# Altium schematic sheet In_Out.SchDoc
size A3
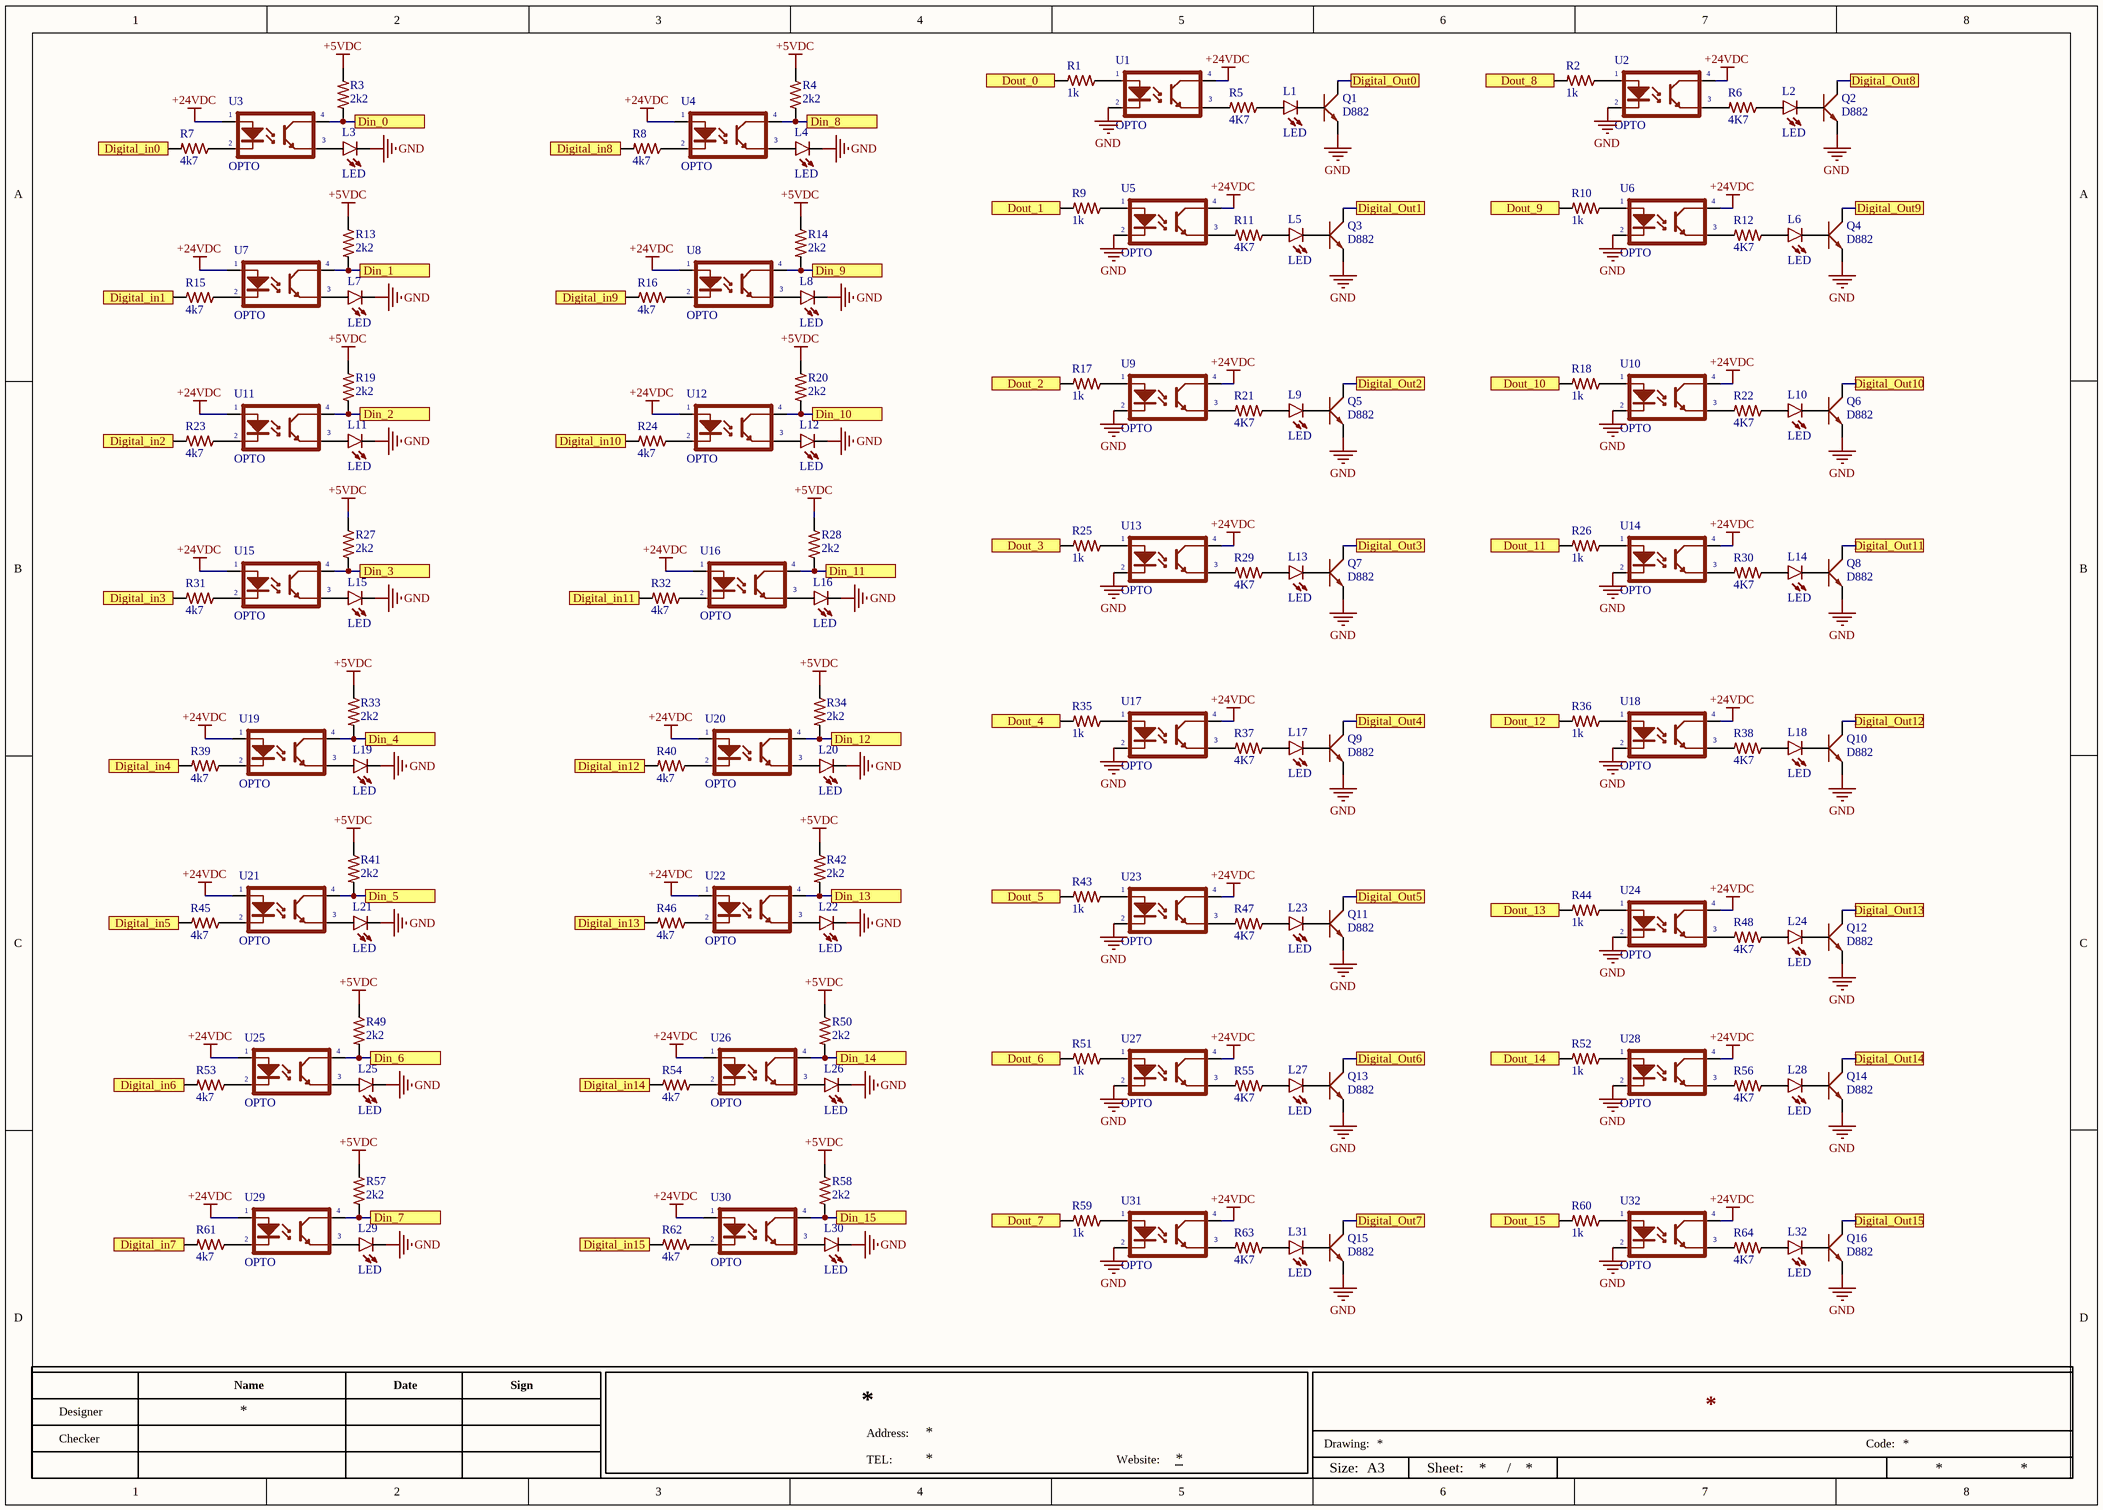
[diagram p0: In_Out.SchDoc]

## Parts
L1  LED  [LED_GREEN_SMD_0603]
L2  LED  [LED_GREEN_SMD_0603]
L3  LED  [LED_RED_SMD_0603]
L4  LED  [LED_RED_SMD_0603]
L5  LED  [LED_GREEN_SMD_0603]
L6  LED  [LED_GREEN_SMD_0603]
L7  LED  [LED_RED_SMD_0603]
L8  LED  [LED_RED_SMD_0603]
L9  LED  [LED_GREEN_SMD_0603]
L10  LED  [LED_GREEN_SMD_0603]
L11  LED  [LED_RED_SMD_0603]
L12  LED  [LED_RED_SMD_0603]
L13  LED  [LED_GREEN_SMD_0603]
L14  LED  [LED_GREEN_SMD_0603]
L15  LED  [LED_RED_SMD_0603]
L16  LED  [LED_RED_SMD_0603]
L17  LED  [LED_GREEN_SMD_0603]
L18  LED  [LED_GREEN_SMD_0603]
L19  LED  [LED_RED_SMD_0603]
L20  LED  [LED_RED_SMD_0603]
L21  LED  [LED_RED_SMD_0603]
L22  LED  [LED_RED_SMD_0603]
L23  LED  [LED_GREEN_SMD_0603]
L24  LED  [LED_GREEN_SMD_0603]
L25  LED  [LED_RED_SMD_0603]
L26  LED  [LED_RED_SMD_0603]
L27  LED  [LED_GREEN_SMD_0603]
L28  LED  [LED_GREEN_SMD_0603]
L29  LED  [LED_RED_SMD_0603]
L30  LED  [LED_RED_SMD_0603]
L31  LED  [LED_GREEN_SMD_0603]
L32  LED  [LED_GREEN_SMD_0603]
Q1  D882  [SOT89]
Q2  D882  [SOT89]
Q3  D882  [SOT89]
Q4  D882  [SOT89]
Q5  D882  [SOT89]
Q6  D882  [SOT89]
Q7  D882  [SOT89]
Q8  D882  [SOT89]
Q9  D882  [SOT89]
Q10  D882  [SOT89]
Q11  D882  [SOT89]
Q12  D882  [SOT89]
Q13  D882  [SOT89]
Q14  D882  [SOT89]
Q15  D882  [SOT89]
Q16  D882  [SOT89]
R1  1k  [RES_SMD0603]
R2  1k  [RES_SMD0603]
R3  2k2  [RES_SMD0603]
R4  2k2  [RES_SMD0603]
R5  4K7  [RES_SMD0603]
R6  4K7  [RES_SMD0603]
R7  4k7  [RES_SMD0603]
R8  4k7  [RES_SMD0603]
R9  1k  [RES_SMD0603]
R10  1k  [RES_SMD0603]
R11  4K7  [RES_SMD0603]
R12  4K7  [RES_SMD0603]
R13  2k2  [RES_SMD0603]
R14  2k2  [RES_SMD0603]
R15  4k7  [RES_SMD0603]
R16  4k7  [RES_SMD0603]
R17  1k  [RES_SMD0603]
R18  1k  [RES_SMD0603]
R19  2k2  [RES_SMD0603]
R20  2k2  [RES_SMD0603]
R21  4K7  [RES_SMD0603]
R22  4K7  [RES_SMD0603]
R23  4k7  [RES_SMD0603]
R24  4k7  [RES_SMD0603]
R25  1k  [RES_SMD0603]
R26  1k  [RES_SMD0603]
R27  2k2  [RES_SMD0603]
R28  2k2  [RES_SMD0603]
R29  4K7  [RES_SMD0603]
R30  4K7  [RES_SMD0603]
R31  4k7  [RES_SMD0603]
R32  4k7  [RES_SMD0603]
R33  2k2  [RES_SMD0603]
R34  2k2  [RES_SMD0603]
R35  1k  [RES_SMD0603]
R36  1k  [RES_SMD0603]
R37  4K7  [RES_SMD0603]
R38  4K7  [RES_SMD0603]
R39  4k7  [RES_SMD0603]
R40  4k7  [RES_SMD0603]
R41  2k2  [RES_SMD0603]
R42  2k2  [RES_SMD0603]
R43  1k  [RES_SMD0603]
R44  1k  [RES_SMD0603]
R45  4k7  [RES_SMD0603]
R46  4k7  [RES_SMD0603]
R47  4K7  [RES_SMD0603]
R48  4K7  [RES_SMD0603]
R49  2k2  [RES_SMD0603]
R50  2k2  [RES_SMD0603]
R51  1k  [RES_SMD0603]
R52  1k  [RES_SMD0603]
R53  4k7  [RES_SMD0603]
R54  4k7  [RES_SMD0603]
R55  4K7  [RES_SMD0603]
R56  4K7  [RES_SMD0603]
R57  2k2  [RES_SMD0603]
R58  2k2  [RES_SMD0603]
R59  1k  [RES_SMD0603]
R60  1k  [RES_SMD0603]
R61  4k7  [RES_SMD0603]
R62  4k7  [RES_SMD0603]
R63  4K7  [RES_SMD0603]
R64  4K7  [RES_SMD0603]
U1  OPTO  [SOP4]
U2  OPTO  [SOP4]
U3  OPTO  [SOP4]
U4  OPTO  [SOP4]
U5  OPTO  [SOP4]
U6  OPTO  [SOP4]
U7  OPTO  [SOP4]
U8  OPTO  [SOP4]
U9  OPTO  [SOP4]
U10  OPTO  [SOP4]
U11  OPTO  [SOP4]
U12  OPTO  [SOP4]
U13  OPTO  [SOP4]
U14  OPTO  [SOP4]
U15  OPTO  [SOP4]
U16  OPTO  [SOP4]
U17  OPTO  [SOP4]
U18  OPTO  [SOP4]
U19  OPTO  [SOP4]
U20  OPTO  [SOP4]
U21  OPTO  [SOP4]
U22  OPTO  [SOP4]
U23  OPTO  [SOP4]
U24  OPTO  [SOP4]
U25  OPTO  [SOP4]
U26  OPTO  [SOP4]
U27  OPTO  [SOP4]
U28  OPTO  [SOP4]
U29  OPTO  [SOP4]
U30  OPTO  [SOP4]
U31  OPTO  [SOP4]
U32  OPTO  [SOP4]

## Ports
Digital_in0, Digital_in1, Digital_in2, Digital_in3, Digital_in4, Digital_in5, Digital_in6, Digital_in7, Digital_in8, Digital_in9, Digital_in10, Digital_in11, Digital_in12, Digital_in13, Digital_in14, Digital_in15, Digital_Out0, Digital_Out1, Digital_Out2, Digital_Out3, Digital_Out4, Digital_Out5, Digital_Out6, Digital_Out7, Digital_Out8, Digital_Out9, Digital_Out10, Digital_Out11, Digital_Out12, Digital_Out13, Digital_Out14, Digital_Out15, Din_0, Din_1, Din_2, Din_3, Din_4, Din_5, Din_6, Din_7, Din_8, Din_9, Din_10, Din_11, Din_12, Din_13, Din_14, Din_15, Dout_0, Dout_1, Dout_2, Dout_3, Dout_4, Dout_5, Dout_6, Dout_7, Dout_8, Dout_9, Dout_10, Dout_11, Dout_12, Dout_13, Dout_14, Dout_15

## Nets
+5VDC: R3.1 R4.1 R13.1 R14.1 R19.1 R20.1 R27.1 R28.1 R33.1 R34.1 R41.1 R42.1 R49.1 R50.1 R57.1 R58.1
+24VDC: U1.4(C) U2.4(C) U3.1(A) U4.1(A) U5.4(C) U6.4(C) U7.1(A) U8.1(A) U9.4(C) U10.4(C) U11.1(A) U12.1(A) U13.4(C) U14.4(C) U15.1(A) U16.1(A) U17.4(C) U18.4(C) U19.1(A) U20.1(A) U21.1(A) U22.1(A) U23.4(C) U24.4(C) U25.1(A) U26.1(A) U27.4(C) U28.4(C) U29.1(A) U30.1(A) U31.4(C) U32.4(C)
GND: L3.2(POS) L4.2(POS) L7.2(POS) L8.2(POS) L11.2(POS) L12.2(POS) L15.2(POS) L16.2(POS) L19.2(POS) L20.2(POS) L21.2(POS) L22.2(POS) L25.2(POS) L26.2(POS) L29.2(POS) L30.2(POS) Q1.2(EMITTER) Q2.2(EMITTER) Q3.2(EMITTER) Q4.2(EMITTER) Q5.2(EMITTER) Q6.2(EMITTER) Q7.2(EMITTER) Q8.2(EMITTER) Q9.2(EMITTER) Q10.2(EMITTER) Q11.2(EMITTER) Q12.2(EMITTER) Q13.2(EMITTER) Q14.2(EMITTER) Q15.2(EMITTER) Q16.2(EMITTER) U1.2(K) U2.2(K) U5.2(K) U6.2(K) U9.2(K) U10.2(K) U13.2(K) U14.2(K) U17.2(K) U18.2(K) U23.2(K) U24.2(K) U27.2(K) U28.2(K) U31.2(K) U32.2(K)
Digital_in0: R7.2 ; port Digital_in0
Digital_in1: R15.2 ; port Digital_in1
Digital_in2: R23.2 ; port Digital_in2
Digital_in3: R31.2 ; port Digital_in3
Digital_in4: R39.2 ; port Digital_in4
Digital_in5: R45.2 ; port Digital_in5
Digital_in6: R53.2 ; port Digital_in6
Digital_in7: R61.2 ; port Digital_in7
Digital_in8: R8.2 ; port Digital_in8
Digital_in9: R16.2 ; port Digital_in9
Digital_in10: R24.2 ; port Digital_in10
Digital_in11: R32.2 ; port Digital_in11
Digital_in12: R40.2 ; port Digital_in12
Digital_in13: R46.2 ; port Digital_in13
Digital_in14: R54.2 ; port Digital_in14
Digital_in15: R62.2 ; port Digital_in15
Digital_Out0: Q1.3(COLLECTOR) ; port Digital_Out0
Digital_Out1: Q3.3(COLLECTOR) ; port Digital_Out1
Digital_Out2: Q5.3(COLLECTOR) ; port Digital_Out2
Digital_Out3: Q7.3(COLLECTOR) ; port Digital_Out3
Digital_Out4: Q9.3(COLLECTOR) ; port Digital_Out4
Digital_Out5: Q11.3(COLLECTOR) ; port Digital_Out5
Digital_Out6: Q13.3(COLLECTOR) ; port Digital_Out6
Digital_Out7: Q15.3(COLLECTOR) ; port Digital_Out7
Digital_Out8: Q2.3(COLLECTOR) ; port Digital_Out8
Digital_Out9: Q4.3(COLLECTOR) ; port Digital_Out9
Digital_Out10: Q6.3(COLLECTOR) ; port Digital_Out10
Digital_Out11: Q8.3(COLLECTOR) ; port Digital_Out11
Digital_Out12: Q10.3(COLLECTOR) ; port Digital_Out12
Digital_Out13: Q12.3(COLLECTOR) ; port Digital_Out13
Digital_Out14: Q14.3(COLLECTOR) ; port Digital_Out14
Digital_Out15: Q16.3(COLLECTOR) ; port Digital_Out15
Din_0: R3.2 U3.4(C) ; port Din_0
Din_1: R13.2 U7.4(C) ; port Din_1
Din_2: R19.2 U11.4(C) ; port Din_2
Din_3: R27.2 U15.4(C) ; port Din_3
Din_4: R33.2 U19.4(C) ; port Din_4
Din_5: R41.2 U21.4(C) ; port Din_5
Din_6: R49.2 U25.4(C) ; port Din_6
Din_7: R57.2 U29.4(C) ; port Din_7
Din_8: R4.2 U4.4(C) ; port Din_8
Din_9: R14.2 U8.4(C) ; port Din_9
Din_10: R20.2 U12.4(C) ; port Din_10
Din_11: R28.2 U16.4(C) ; port Din_11
Din_12: R34.2 U20.4(C) ; port Din_12
Din_13: R42.2 U22.4(C) ; port Din_13
Din_14: R50.2 U26.4(C) ; port Din_14
Din_15: R58.2 U30.4(C) ; port Din_15
Dout_0: R1.2 ; port Dout_0
Dout_1: R9.2 ; port Dout_1
Dout_2: R17.2 ; port Dout_2
Dout_3: R25.2 ; port Dout_3
Dout_4: R35.2 ; port Dout_4
Dout_5: R43.2 ; port Dout_5
Dout_6: R51.2 ; port Dout_6
Dout_7: R59.2 ; port Dout_7
Dout_8: R2.2 ; port Dout_8
Dout_9: R10.2 ; port Dout_9
Dout_10: R18.2 ; port Dout_10
Dout_11: R26.2 ; port Dout_11
Dout_12: R36.2 ; port Dout_12
Dout_13: R44.2 ; port Dout_13
Dout_14: R52.2 ; port Dout_14
Dout_15: R60.2 ; port Dout_15
NetL1_1: L1.1(NEG) R5.1
NetL1_2: L1.2(POS) Q1.1(BASE)
NetL2_1: L2.1(NEG) R6.1
NetL2_2: L2.2(POS) Q2.1(BASE)
NetL3_1: L3.1(NEG) U3.3(E)
NetL4_1: L4.1(NEG) U4.3(E)
NetL5_1: L5.1(NEG) R11.1
NetL5_2: L5.2(POS) Q3.1(BASE)
NetL6_1: L6.1(NEG) R12.1
NetL6_2: L6.2(POS) Q4.1(BASE)
NetL7_1: L7.1(NEG) U7.3(E)
NetL8_1: L8.1(NEG) U8.3(E)
NetL9_1: L9.1(NEG) R21.1
NetL9_2: L9.2(POS) Q5.1(BASE)
NetL10_1: L10.1(NEG) R22.1
NetL10_2: L10.2(POS) Q6.1(BASE)
NetL11_1: L11.1(NEG) U11.3(E)
NetL12_1: L12.1(NEG) U12.3(E)
NetL13_1: L13.1(NEG) R29.1
NetL13_2: L13.2(POS) Q7.1(BASE)
NetL14_1: L14.1(NEG) R30.1
NetL14_2: L14.2(POS) Q8.1(BASE)
NetL15_1: L15.1(NEG) U15.3(E)
NetL16_1: L16.1(NEG) U16.3(E)
NetL17_1: L17.1(NEG) R37.1
NetL17_2: L17.2(POS) Q9.1(BASE)
NetL18_1: L18.1(NEG) R38.1
NetL18_2: L18.2(POS) Q10.1(BASE)
NetL19_1: L19.1(NEG) U19.3(E)
NetL20_1: L20.1(NEG) U20.3(E)
NetL21_1: L21.1(NEG) U21.3(E)
NetL22_1: L22.1(NEG) U22.3(E)
NetL23_1: L23.1(NEG) R47.1
NetL23_2: L23.2(POS) Q11.1(BASE)
NetL24_1: L24.1(NEG) R48.1
NetL24_2: L24.2(POS) Q12.1(BASE)
NetL25_1: L25.1(NEG) U25.3(E)
NetL26_1: L26.1(NEG) U26.3(E)
NetL27_1: L27.1(NEG) R55.1
NetL27_2: L27.2(POS) Q13.1(BASE)
NetL28_1: L28.1(NEG) R56.1
NetL28_2: L28.2(POS) Q14.1(BASE)
NetL29_1: L29.1(NEG) U29.3(E)
NetL30_1: L30.1(NEG) U30.3(E)
NetL31_1: L31.1(NEG) R63.1
NetL31_2: L31.2(POS) Q15.1(BASE)
NetL32_1: L32.1(NEG) R64.1
NetL32_2: L32.2(POS) Q16.1(BASE)
NetR1_1: R1.1 U1.1(A)
NetR2_1: R2.1 U2.1(A)
NetR5_2: R5.2 U1.3(E)
NetR6_2: R6.2 U2.3(E)
NetR7_1: R7.1 U3.2(K)
NetR8_1: R8.1 U4.2(K)
NetR9_1: R9.1 U5.1(A)
NetR10_1: R10.1 U6.1(A)
NetR11_2: R11.2 U5.3(E)
NetR12_2: R12.2 U6.3(E)
NetR15_1: R15.1 U7.2(K)
NetR16_1: R16.1 U8.2(K)
NetR17_1: R17.1 U9.1(A)
NetR18_1: R18.1 U10.1(A)
NetR21_2: R21.2 U9.3(E)
NetR22_2: R22.2 U10.3(E)
NetR23_1: R23.1 U11.2(K)
NetR24_1: R24.1 U12.2(K)
NetR25_1: R25.1 U13.1(A)
NetR26_1: R26.1 U14.1(A)
NetR29_2: R29.2 U13.3(E)
NetR30_2: R30.2 U14.3(E)
NetR31_1: R31.1 U15.2(K)
NetR32_1: R32.1 U16.2(K)
NetR35_1: R35.1 U17.1(A)
NetR36_1: R36.1 U18.1(A)
NetR37_2: R37.2 U17.3(E)
NetR38_2: R38.2 U18.3(E)
NetR39_1: R39.1 U19.2(K)
NetR40_1: R40.1 U20.2(K)
NetR43_1: R43.1 U23.1(A)
NetR44_1: R44.1 U24.1(A)
NetR45_1: R45.1 U21.2(K)
NetR46_1: R46.1 U22.2(K)
NetR47_2: R47.2 U23.3(E)
NetR48_2: R48.2 U24.3(E)
NetR51_1: R51.1 U27.1(A)
NetR52_1: R52.1 U28.1(A)
NetR53_1: R53.1 U25.2(K)
NetR54_1: R54.1 U26.2(K)
NetR55_2: R55.2 U27.3(E)
NetR56_2: R56.2 U28.3(E)
NetR59_1: R59.1 U31.1(A)
NetR60_1: R60.1 U32.1(A)
NetR61_1: R61.1 U29.2(K)
NetR62_1: R62.1 U30.2(K)
NetR63_2: R63.2 U31.3(E)
NetR64_2: R64.2 U32.3(E)

## Notes on the sheet
- Name
- Date
- Sign
- Designer
- Checker
- Address:
- TEL:
- Website:
- Drawing:
- Size:
- A3
- Sheet:
- /
- Code:

## Library data of the parts
L1-L32 = LED: Lighting Eminter Diode
Q1-Q16 = Tranzitor NPN: pin to pad: 2>3 3>2
R1-R64 = Resistor